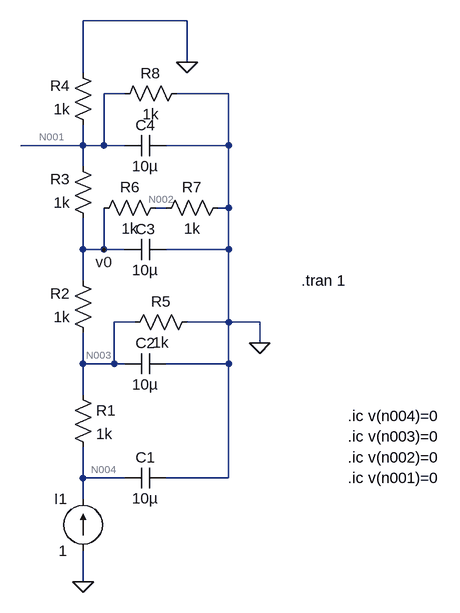
[diagram p0: schematic dos.asc]
dos.asc, the LTspice schematic file:
Version 4
SHEET 1 880 680
WIRE 272 -544 112 -544
WIRE 272 -480 272 -544
WIRE 112 -464 112 -544
WIRE 176 -432 144 -432
WIRE 336 -432 256 -432
WIRE 112 -352 112 -384
WIRE 112 -352 16 -352
WIRE 144 -352 144 -432
WIRE 144 -352 112 -352
WIRE 176 -352 144 -352
WIRE 336 -352 336 -432
WIRE 336 -352 240 -352
WIRE 112 -320 112 -352
WIRE 240 -256 224 -256
WIRE 336 -256 336 -352
WIRE 336 -256 320 -256
WIRE 112 -192 112 -240
WIRE 144 -192 144 -256
WIRE 144 -192 112 -192
WIRE 176 -192 144 -192
WIRE 336 -192 336 -256
WIRE 336 -192 240 -192
WIRE 112 -144 112 -192
WIRE 192 -80 160 -80
WIRE 336 -80 336 -192
WIRE 336 -80 272 -80
WIRE 384 -80 336 -80
WIRE 384 -48 384 -80
WIRE 112 -16 112 -64
WIRE 160 -16 160 -80
WIRE 160 -16 112 -16
WIRE 176 -16 160 -16
WIRE 336 -16 336 -80
WIRE 336 -16 240 -16
WIRE 112 32 112 -16
WIRE 112 160 112 112
WIRE 176 160 112 160
WIRE 336 160 336 -16
WIRE 336 160 240 160
WIRE 112 192 112 160
WIRE 112 320 112 272
FLAG 112 320 0
FLAG 272 -480 0
FLAG 144 -192 v0
FLAG 384 -48 0
SYMBOL current 112 272 R180
WINDOW 0 24 80 Left 2
WINDOW 3 24 0 Left 2
WINDOW 123 0 0 Left 0
WINDOW 39 0 0 Left 0
SYMATTR InstName I1
SYMATTR Value 1
SYMBOL cap 240 144 R90
WINDOW 0 0 32 VBottom 2
WINDOW 3 32 32 VTop 2
SYMATTR InstName C1
SYMATTR Value 10µ
SYMBOL res 96 16 R0
SYMATTR InstName R1
SYMATTR Value 1k
SYMBOL cap 240 -32 R90
WINDOW 0 0 32 VBottom 2
WINDOW 3 32 32 VTop 2
SYMATTR InstName C2
SYMATTR Value 10µ
SYMBOL res 128 -48 R180
WINDOW 0 36 76 Left 2
WINDOW 3 36 40 Left 2
SYMATTR InstName R2
SYMATTR Value 1k
SYMBOL res 128 -224 R180
WINDOW 0 36 76 Left 2
WINDOW 3 36 40 Left 2
SYMATTR InstName R3
SYMATTR Value 1k
SYMBOL res 128 -368 R180
WINDOW 0 36 76 Left 2
WINDOW 3 36 40 Left 2
SYMATTR InstName R4
SYMATTR Value 1k
SYMBOL cap 240 -208 R90
WINDOW 0 0 32 VBottom 2
WINDOW 3 32 32 VTop 2
SYMATTR InstName C3
SYMATTR Value 10µ
SYMBOL cap 240 -368 R90
WINDOW 0 0 32 VBottom 2
WINDOW 3 32 32 VTop 2
SYMATTR InstName C4
SYMATTR Value 10µ
SYMBOL res 288 -96 R90
WINDOW 0 0 56 VBottom 2
WINDOW 3 32 56 VTop 2
SYMATTR InstName R5
SYMATTR Value 1k
SYMBOL res 240 -272 R90
WINDOW 0 0 56 VBottom 2
WINDOW 3 32 56 VTop 2
SYMATTR InstName R6
SYMATTR Value 1k
SYMBOL res 336 -272 R90
WINDOW 0 0 56 VBottom 2
WINDOW 3 32 56 VTop 2
SYMATTR InstName R7
SYMATTR Value 1k
SYMBOL res 272 -448 R90
WINDOW 0 0 56 VBottom 2
WINDOW 3 32 56 VTop 2
SYMATTR InstName R8
SYMATTR Value 1k
TEXT 448 -144 Left 2 !.tran 1
TEXT 520 64 Left 2 !.ic v(n004)=0
TEXT 520 96 Left 2 !.ic v(n003)=0
TEXT 520 128 Left 2 !.ic v(n002)=0
TEXT 520 160 Left 2 !.ic v(n001)=0

The netlist it stands for:
* dos.asc
I1 0 N004 1
C1 0 N004 10µ
R1 N003 N004 1k
C2 0 N003 10µ
R2 N003 v0 1k
R3 v0 N001 1k
R4 N001 0 1k
C3 0 v0 10µ
C4 0 N001 10µ
R5 0 N003 1k
R6 N002 v0 1k
R7 0 N002 1k
R8 0 N001 1k
.tran 1
.ic v(n004)=0
.ic v(n003)=0
.ic v(n002)=0
.ic v(n001)=0
.backanno
.end